# Altium schematic sheet Connectors.SchDoc
size A4; Organization: Altium Limited; Address1: L3, 12a Rodborough Rd; Address2: Frenchs Forest; Address3: NSW; Address4: Australia 2086
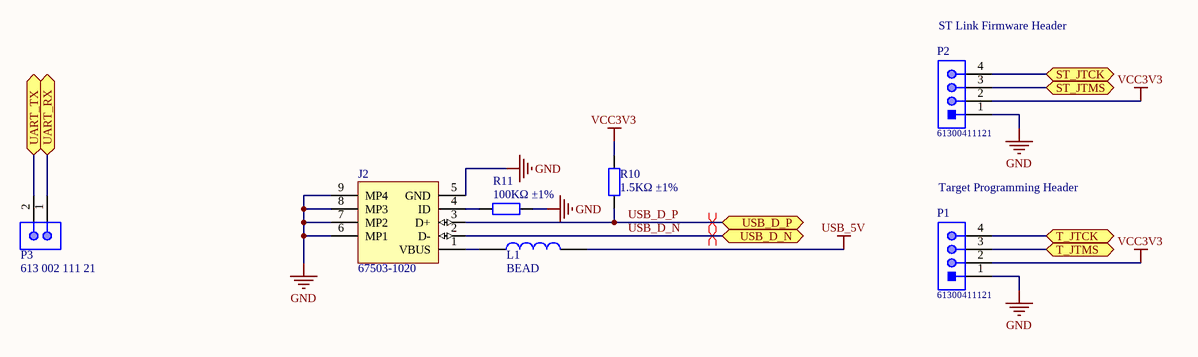
[diagram p0: Connectors.SchDoc]

## Parts
J2  67503-1020  [MOLX-67503-1020_V]
L1  BEAD  [0603_L]
P1  61300411121  [61300411121]
P2  61300411121  [61300411121]
P3  613 002 111 21  [WE-61300211121_V]
R10  1.5KΩ ±1%  [0402_R]
R11  100KΩ ±1%  [0402_R]

## Ports
ST_JTCK (bidir), ST_JTMS (bidir), T_JTCK (bidir), T_JTMS (bidir), UART_RX (bidir), UART_TX (bidir), USB_D_N (bidir), USB_D_P (bidir)

## Nets
GND: J2.5(GND) J2.6(MP1) J2.7(MP2) J2.8(MP3) J2.9(MP4) P1.1 P2.1 R11.2
USB_5V: L1.2
VCC3V3: P1.2 P2.2 R10.2
ST_JTCK: P2.4 ; port ST_JTCK
ST_JTMS: P2.3 ; port ST_JTMS
T_JTCK: P1.4 ; port T_JTCK
T_JTMS: P1.3 ; port T_JTMS
UART_RX: P3.1 ; port UART_RX
UART_TX: P3.2 ; port UART_TX
USB_D_N: J2.2(D-) ; port USB_D_N
USB_D_P: J2.3(D+) R10.1 ; port USB_D_P
NetJ2_1: J2.1(VBUS) L1.1
NetJ2_4: J2.4(ID) R11.1

## Layout directives
differential pair: USB_D_N, USB_D_P

## Notes on the sheet
- (near P2) ST Link Firmware Header
- (near P1) Target Programming Header
- Title
- Size:
- Date:
- A4
- Number:
- Time:
- Revision:
- Sheet
- of
- File:

## Library data of the parts
J2 = CMP-0411-00002-1: USB, MINI, SMD, RA KME04-USBMU03A01; Manufacturer: Molex; ComponentLink1URL: http://www.molex.com/; PartNumber: 67503-1020; Mounting Technology: Surface Mount; ComponentLink1Description: Manufacturer URL; Terminal Pitch: 0.8 mm; DatasheetVersion: Rev F, 06/2009; ComponentLink2Description: Datasheet; PackageDescription: Mini USB Connector, SMT, Righer Angle; ComponentLink2URL: http://www.molex.com/pdm_docs/sd/675031020_sd.pdf; PackageReference: 67503-1020
L1 = 0603 100R@100Mhz 1A: Ferrite Bead; Notepad: *; Package: 0603; Supplier: LC; SuppliersPartNumber: C64181
P1 P2 = CMP-1502-01064-1: THT Vertical Pin Header WR-PHD, Pitch 2.54 mm, Single Row, 4 pins; Manufacturer: Wurth Elektronik; Withstanding Voltage: 500VAC; Rated Current: 3A; Working Voltage: 250VAC; Pin Number: 4; Gender: Male; Contact Resistance: 20mOhm; Pitch: 2.54mm; Manufacturer URL: http://www.we-online.de; Operating Temperature: -40to105degC; Packaging: Bag; Mounting Technology: THT; Package Reference: 61300411121; Datasheet URL: https://katalog.we-online.de/em/datasheet/6130xx11121.pdf; Publisher: WurthElektronik; Part Number: 61300411121; Row Number: Single; Orientation: Vertical
P3 = CMP-1712-00002-3: Male Header, Pitch 2.54 mm, 1 x 2 Position, Height 8.54 mm, Tail Length 3 mm, -40 to 105 degC, RoHS, Bulk; Mounting Technology: Through Hole; Packaging: Bulk; Pins: 2; REACH SVHC: No SVHC; PartNumber: 613 002 111 21; PackageDescription: Male Header, Pitch 2.54 mm, 1 x 2 Position, Height 8.54 mm, Tail Length 3 mm; ComponentLink1Description: Manufacturer URL; Max Operating Temperature: 125 degC; ComponentLink1URL: https://www.we-online.com/; ComponentLink2Description: Datasheet; Mount: Through Hole; DatasheetVersion: Rev. J; Min Operating Temperature: -40 degC; ComponentLink2URL: http://katalog.we-online.de/em/datasheet/6130xx11121.pdf; RoHSCompliant: True
R10 = 0402 1.5K (1501) 1%: Chip resistor; Manufacturer: Uniroyal Elec; PartNumber: 0402WGF1501TCE; Power: 1/16W; ComponentLink1Description: Supplier link; ComponentLink1URL: http://www.szlcsc.com/product/details_26610.html; Package: 0402; Supplier: LC; SuppliersPartNumber: C25867; Resistance: 1.5KΩ; Tolerance: 1%
R11 = 0402 100K (1003) 1%: Chip resistor; Manufacturer: Uniroyal Elec; PartNumber: 0402WGF1003TCE; Power: 1/16W; ComponentLink1Description: Supplier link; ComponentLink1URL: http://www.szlcsc.com/product/details_26484.html; Package: 0402; Supplier: LC; SuppliersPartNumber: C25741; Resistance: 100KΩ; Tolerance: 1%